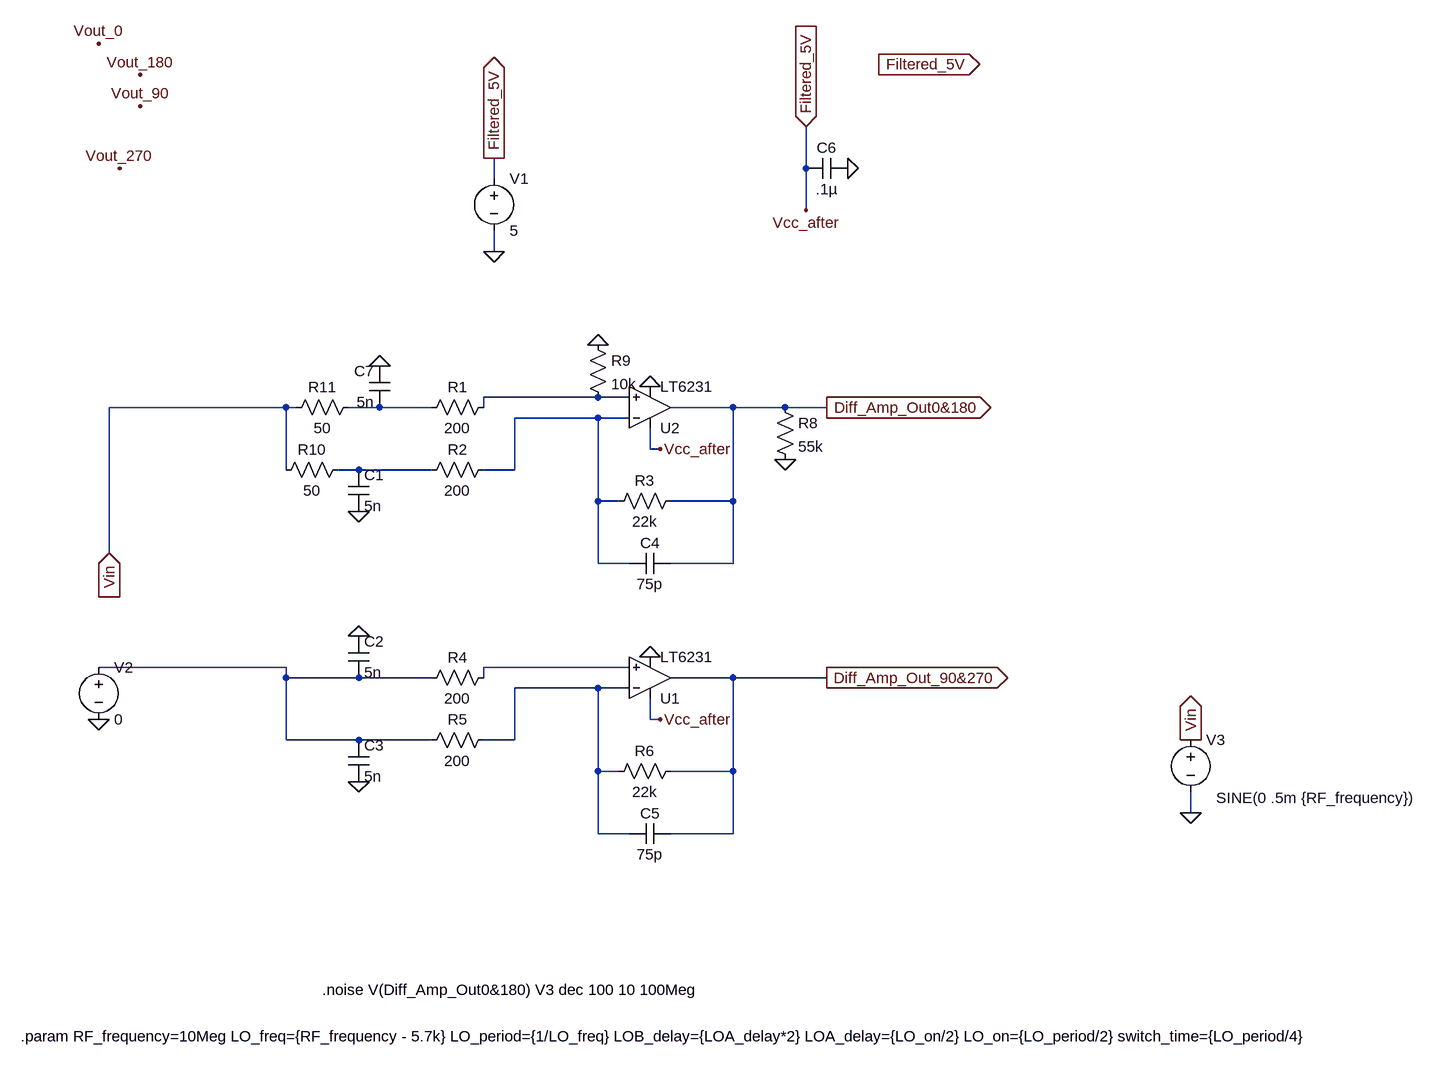
[diagram p0: schematic Noise Simulation.asc]
Noise Simulation.asc, the LTspice schematic file:
Version 4
SHEET 1 1300 680
WIRE 256 -912 256 -976
WIRE -224 -896 -224 -928
WIRE 256 -848 256 -912
WIRE -224 -784 -224 -816
WIRE -64 -560 -240 -560
WIRE -16 -560 -64 -560
WIRE -544 -544 -816 -544
WIRE -528 -544 -544 -544
WIRE -400 -544 -448 -544
WIRE -320 -544 -400 -544
WIRE -240 -544 -240 -560
WIRE 144 -544 48 -544
WIRE 224 -544 144 -544
WIRE 288 -544 224 -544
WIRE -64 -528 -192 -528
WIRE -16 -528 -64 -528
WIRE 16 -480 16 -512
WIRE 32 -480 16 -480
WIRE -544 -448 -544 -544
WIRE -432 -448 -464 -448
WIRE -320 -448 -432 -448
WIRE -192 -448 -192 -528
WIRE -192 -448 -240 -448
WIRE -64 -400 -64 -528
WIRE -32 -400 -64 -400
WIRE 144 -400 144 -544
WIRE 144 -400 48 -400
WIRE -816 -320 -816 -544
WIRE -64 -304 -64 -400
WIRE -16 -304 -64 -304
WIRE 144 -304 144 -400
WIRE 144 -304 48 -304
WIRE -544 -144 -832 -144
WIRE -16 -144 -240 -144
WIRE -544 -128 -544 -144
WIRE -432 -128 -544 -128
WIRE -320 -128 -432 -128
WIRE -240 -128 -240 -144
WIRE 144 -128 48 -128
WIRE 288 -128 144 -128
WIRE -64 -112 -192 -112
WIRE -16 -112 -64 -112
WIRE 16 -64 16 -96
WIRE 32 -64 16 -64
WIRE -544 -32 -544 -128
WIRE -432 -32 -544 -32
WIRE -320 -32 -432 -32
WIRE -192 -32 -192 -112
WIRE -192 -32 -240 -32
WIRE -64 16 -64 -112
WIRE -32 16 -64 16
WIRE 144 16 144 -128
WIRE 144 16 48 16
WIRE 848 80 848 48
WIRE -64 112 -64 16
WIRE -16 112 -64 112
WIRE 144 112 144 16
WIRE 144 112 48 112
FLAG 16 -576 0
FLAG -432 -384 0
FLAG 16 -160 0
FLAG -432 -192 0
FLAG -432 32 0
FLAG -832 -1104 Vout_0
FLAG -768 -1008 Vout_90
FLAG -768 -1056 Vout_180
FLAG -800 -912 Vout_270
FLAG 32 -480 Vcc_after
FLAG 32 -64 Vcc_after
FLAG 288 -128 Diff_Amp_Out_90&270
IOPIN 288 -128 Out
FLAG 288 -544 Diff_Amp_Out0&180
IOPIN 288 -544 Out
FLAG 320 -912 0
FLAG 256 -848 Vcc_after
FLAG 368 -1072 Filtered_5V
IOPIN 368 -1072 Out
FLAG -224 -784 0
FLAG -224 -928 Filtered_5V
IOPIN -224 -928 Out
FLAG 256 -976 Filtered_5V
IOPIN 256 -976 In
FLAG 848 80 0
FLAG 848 -32 Vin
IOPIN 848 -32 Out
FLAG -816 -320 Vin
IOPIN -816 -320 In
FLAG 224 -464 0
FLAG -832 -64 0
FLAG -64 -640 0
FLAG -400 -608 0
SYMBOL res -224 -560 R90
WINDOW 0 0 56 VBottom 2
WINDOW 3 32 56 VTop 2
SYMATTR InstName R1
SYMATTR Value 200
SYMBOL res -224 -464 R90
WINDOW 0 0 56 VBottom 2
WINDOW 3 32 56 VTop 2
SYMATTR InstName R2
SYMATTR Value 200
SYMBOL res 64 -416 R90
WINDOW 0 0 56 VBottom 2
WINDOW 3 32 56 VTop 2
SYMATTR InstName R3
SYMATTR Value 22k
SYMBOL cap -448 -448 R0
SYMATTR InstName C1
SYMATTR Value 5n
SYMBOL res -224 -144 R90
WINDOW 0 0 56 VBottom 2
WINDOW 3 32 56 VTop 2
SYMATTR InstName R4
SYMATTR Value 200
SYMBOL res -224 -48 R90
WINDOW 0 0 56 VBottom 2
WINDOW 3 32 56 VTop 2
SYMATTR InstName R5
SYMATTR Value 200
SYMBOL res 64 0 R90
WINDOW 0 0 56 VBottom 2
WINDOW 3 32 56 VTop 2
SYMATTR InstName R6
SYMATTR Value 22k
SYMBOL cap -448 -192 R0
SYMATTR InstName C2
SYMATTR Value 5n
SYMBOL cap -448 -32 R0
SYMATTR InstName C3
SYMATTR Value 5n
SYMBOL OpAmps\\LT6231 16 -128 M180
SYMATTR InstName U1
SYMBOL OpAmps\\LT6231 16 -544 M180
SYMATTR InstName U2
SYMBOL cap 48 -320 R90
WINDOW 0 0 32 VBottom 2
WINDOW 3 32 32 VTop 2
SYMATTR InstName C4
SYMATTR Value 75p
SYMBOL cap 48 96 R90
WINDOW 0 0 32 VBottom 2
WINDOW 3 32 32 VTop 2
SYMATTR InstName C5
SYMATTR Value 75p
SYMBOL cap 320 -928 R90
WINDOW 0 0 32 VBottom 2
WINDOW 3 32 32 VTop 2
SYMATTR InstName C6
SYMATTR Value .1µ
SYMBOL voltage -224 -912 R0
WINDOW 123 0 0 Left 0
WINDOW 39 0 0 Left 0
SYMATTR InstName V1
SYMATTR Value 5
SYMBOL voltage 848 -48 R0
WINDOW 123 40 48 Left 2
WINDOW 39 39 77 Left 2
WINDOW 3 39 105 Left 2
SYMATTR Value SINE(0 .5m {RF_frequency})
SYMATTR InstName V3
SYMBOL res 208 -560 R0
SYMATTR InstName R8
SYMATTR Value 55k
SYMBOL voltage -832 -160 R0
WINDOW 123 0 0 Left 0
WINDOW 39 0 0 Left 0
SYMATTR InstName V2
SYMATTR Value 0
SYMBOL res -80 -656 R0
SYMATTR InstName R9
SYMATTR Value 10k
SYMBOL cap -384 -544 R180
WINDOW 0 24 56 Left 2
WINDOW 3 24 8 Left 2
SYMATTR InstName C7
SYMATTR Value 5n
SYMBOL res -448 -464 R90
WINDOW 0 0 56 VBottom 2
WINDOW 3 32 56 VTop 2
SYMATTR InstName R10
SYMATTR Value 50
SYMBOL res -432 -560 R90
WINDOW 0 0 56 VBottom 2
WINDOW 3 32 56 VTop 2
SYMATTR InstName R11
SYMATTR Value 50
TEXT -488 352 Left 2 !.noise V(Diff_Amp_Out0&180) V3 dec 100 10 100Meg
TEXT -952 424 Left 2 !.param RF_frequency=10Meg LO_freq={RF_frequency - 5.7k} LO_period={1/LO_freq} LOB_delay={LOA_delay*2} LOA_delay={LO_on/2} LO_on={LO_period/2} switch_time={LO_period/4}

The netlist it stands for:
* Noise Simulation.asc
R1 N001 N002 200
R2 N003 N004 200
R3 Diff_Amp_Out0&180 N003 22k
C1 N004 0 5n
R4 N006 N005 200
R5 N007 N005 200
R6 Diff_Amp_Out_90&270 N007 22k
C2 0 N005 5n
C3 N005 0 5n
XU1 N006 N007 Diff_Amp_Out_90&270 Filtered_5V 0 LT6231  ; pins In+ In- OUT V+ V-
XU2 N001 N003 Diff_Amp_Out0&180 Filtered_5V 0 LT6231  ; pins In+ In- OUT V+ V-
C4 Diff_Amp_Out0&180 N003 75p
C5 Diff_Amp_Out_90&270 N007 75p
C6 0 Filtered_5V .1µ
V1 Filtered_5V 0 5
V3 Vin 0 SINE(0 .5m {RF_frequency})
R8 Diff_Amp_Out0&180 0 55k
V2 N005 0 0
R9 0 N001 10k
C7 N002 0 5n
R10 N004 Vin 50
R11 N002 Vin 50
.noise V(Diff_Amp_Out0&180) V3 dec 100 10 100Meg
.param RF_frequency=10Meg LO_freq={RF_frequency - 5.7k} LO_period={1/LO_freq} LOB_delay={LOA_delay*2} LOA_delay={LO_on/2} LO_on={LO_period/2} switch_time={LO_period/4}
.lib LTC2.lib
.backanno
.end